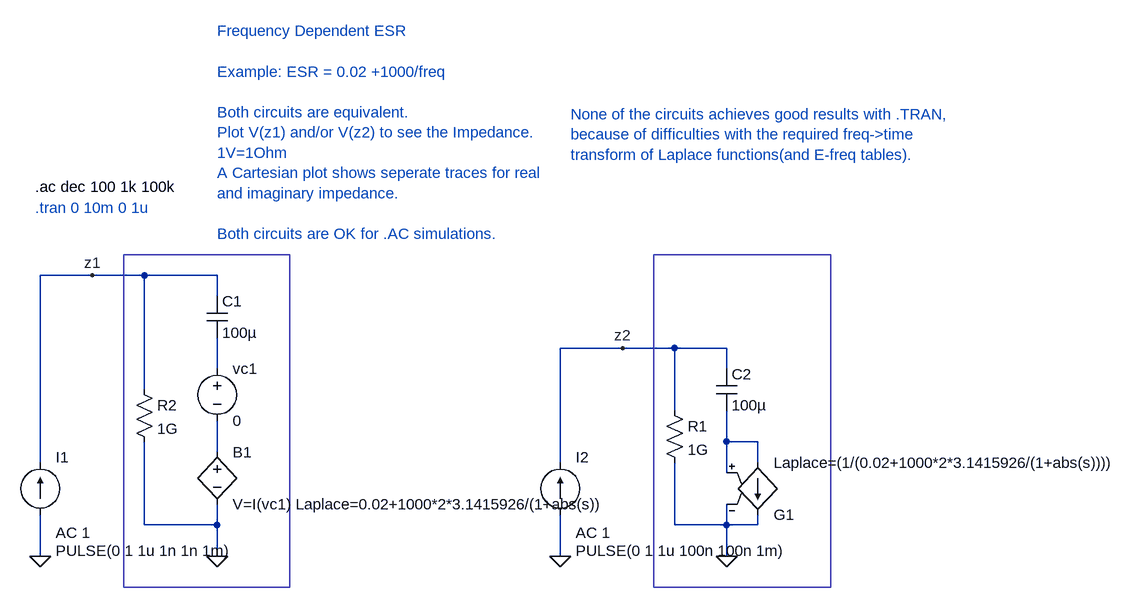
[diagram p0: schematic ESR_freq1.asc]
ESR_freq1.asc, the LTspice schematic file:
Version 4
SHEET 1 2216 680
WIRE -48 -64 -128 -64
WIRE 32 -64 -48 -64
WIRE 144 -64 32 -64
WIRE 144 -32 144 -64
WIRE 768 48 672 48
WIRE 848 48 768 48
WIRE 928 48 848 48
WIRE 144 80 144 32
WIRE 928 80 928 48
WIRE 32 112 32 -64
WIRE 848 144 848 48
WIRE 928 192 928 144
WIRE 976 192 928 192
WIRE 144 208 144 160
WIRE -128 224 -128 -64
WIRE 672 224 672 48
WIRE 976 224 976 192
WIRE 928 240 928 192
WIRE 32 320 32 192
WIRE 144 320 144 288
WIRE 144 320 32 320
WIRE 848 320 848 224
WIRE 928 320 928 288
WIRE 928 320 848 320
WIRE 976 320 976 304
WIRE 976 320 928 320
WIRE -128 368 -128 304
WIRE 144 368 144 320
WIRE 672 368 672 304
WIRE 928 368 928 320
FLAG 144 368 0
FLAG -128 368 0
FLAG 928 368 0
FLAG 672 368 0
FLAG -48 -64 z1
FLAG 768 48 z2
SYMBOL bv 144 192 R0
SYMATTR InstName B1
SYMATTR Value V=I(vc1) Laplace=0.02+1000*2*3.1415926/(1+abs(s))
SYMBOL current -128 304 M180
WINDOW 0 24 88 Left 0
WINDOW 3 24 -56 Left 0
WINDOW 123 24 -28 Left 0
WINDOW 39 0 0 Left 0
SYMATTR InstName I1
SYMATTR Value PULSE(0 1 1u 1n 1n 1m)
SYMATTR Value2 AC 1
SYMBOL cap 128 -32 R0
SYMATTR InstName C1
SYMATTR Value 100µ
SYMBOL voltage 144 64 R0
SYMATTR InstName vc1
SYMATTR Value 0
SYMBOL cap 912 80 R0
SYMATTR InstName C2
SYMATTR Value 100µ
SYMBOL g2 976 320 M180
SYMATTR InstName G1
SYMATTR Value Laplace=(1/(0.02+1000*2*3.1415926/(1+abs(s))))
SYMBOL res 832 128 R0
SYMATTR InstName R1
SYMATTR Value 1G
SYMBOL res 16 96 R0
SYMATTR InstName R2
SYMATTR Value 1G
SYMBOL current 672 304 M180
WINDOW 0 24 88 Left 0
WINDOW 3 24 -56 Left 0
WINDOW 123 24 -28 Left 0
WINDOW 39 0 0 Left 0
SYMATTR InstName I2
SYMATTR Value PULSE(0 1 1u 100n 100n 1m)
SYMATTR Value2 AC 1
TEXT -136 -200 Left 0 !.ac dec 100 1k 100k
TEXT 144 -440 Left 0 ;Frequency Dependent ESR\n \nExample: ESR = 0.02 +1000/freq\n \nBoth circuits are equivalent.\nPlot V(z1) and/or V(z2) to see the Impedance.\n1V=1Ohm\nA Cartesian plot shows seperate traces for real \nand imaginary impedance.\n \nBoth circuits are OK for .AC simulations.
TEXT -136 -168 Left 0 ;.tran 0 10m 0 1u
TEXT 688 -312 Left 0 ;None of the circuits achieves good results with .TRAN,\nbecause of difficulties with the required freq->time \ntransform of Laplace functions(and E-freq tables).
RECTANGLE Normal 256 416 0 -96
RECTANGLE Normal 1088 416 816 -96

The netlist it stands for:
* ESR_freq1.asc
B1 N003 0 V=I(vc1) Laplace=0.02+1000*2*3.1415926/(1+abs(s))
I1 0 z1 PULSE(0 1 1u 1n 1n 1m) AC 1
C1 z1 N001 100µ
vc1 N001 N003 0
C2 z2 N002 100µ
G1 N002 0 N002 0 Laplace=(1/(0.02+1000*2*3.1415926/(1+abs(s))))
R1 z2 0 1G
R2 z1 0 1G
I2 0 z2 PULSE(0 1 1u 100n 100n 1m) AC 1
.ac dec 100 1k 100k
* Frequency Dependent ESR
* Example: ESR = 0.02 +1000/freq
* Both circuits are equivalent.
* Plot V(z1) and/or V(z2) to see the Impedance.
* 1V=1Ohm
* A Cartesian plot shows seperate traces for real
* and imaginary impedance.
* Both circuits are OK for .AC simulations.
* .tran 0 10m 0 1u
* None of the circuits achieves good results with .TRAN,
* because of difficulties with the required freq->time
* transform of Laplace functions(and E-freq tables).
.backanno
.end